# EAGLE design SUSTAINA-Power-Supply-Switching-Board (EAGLE 9.6.2)
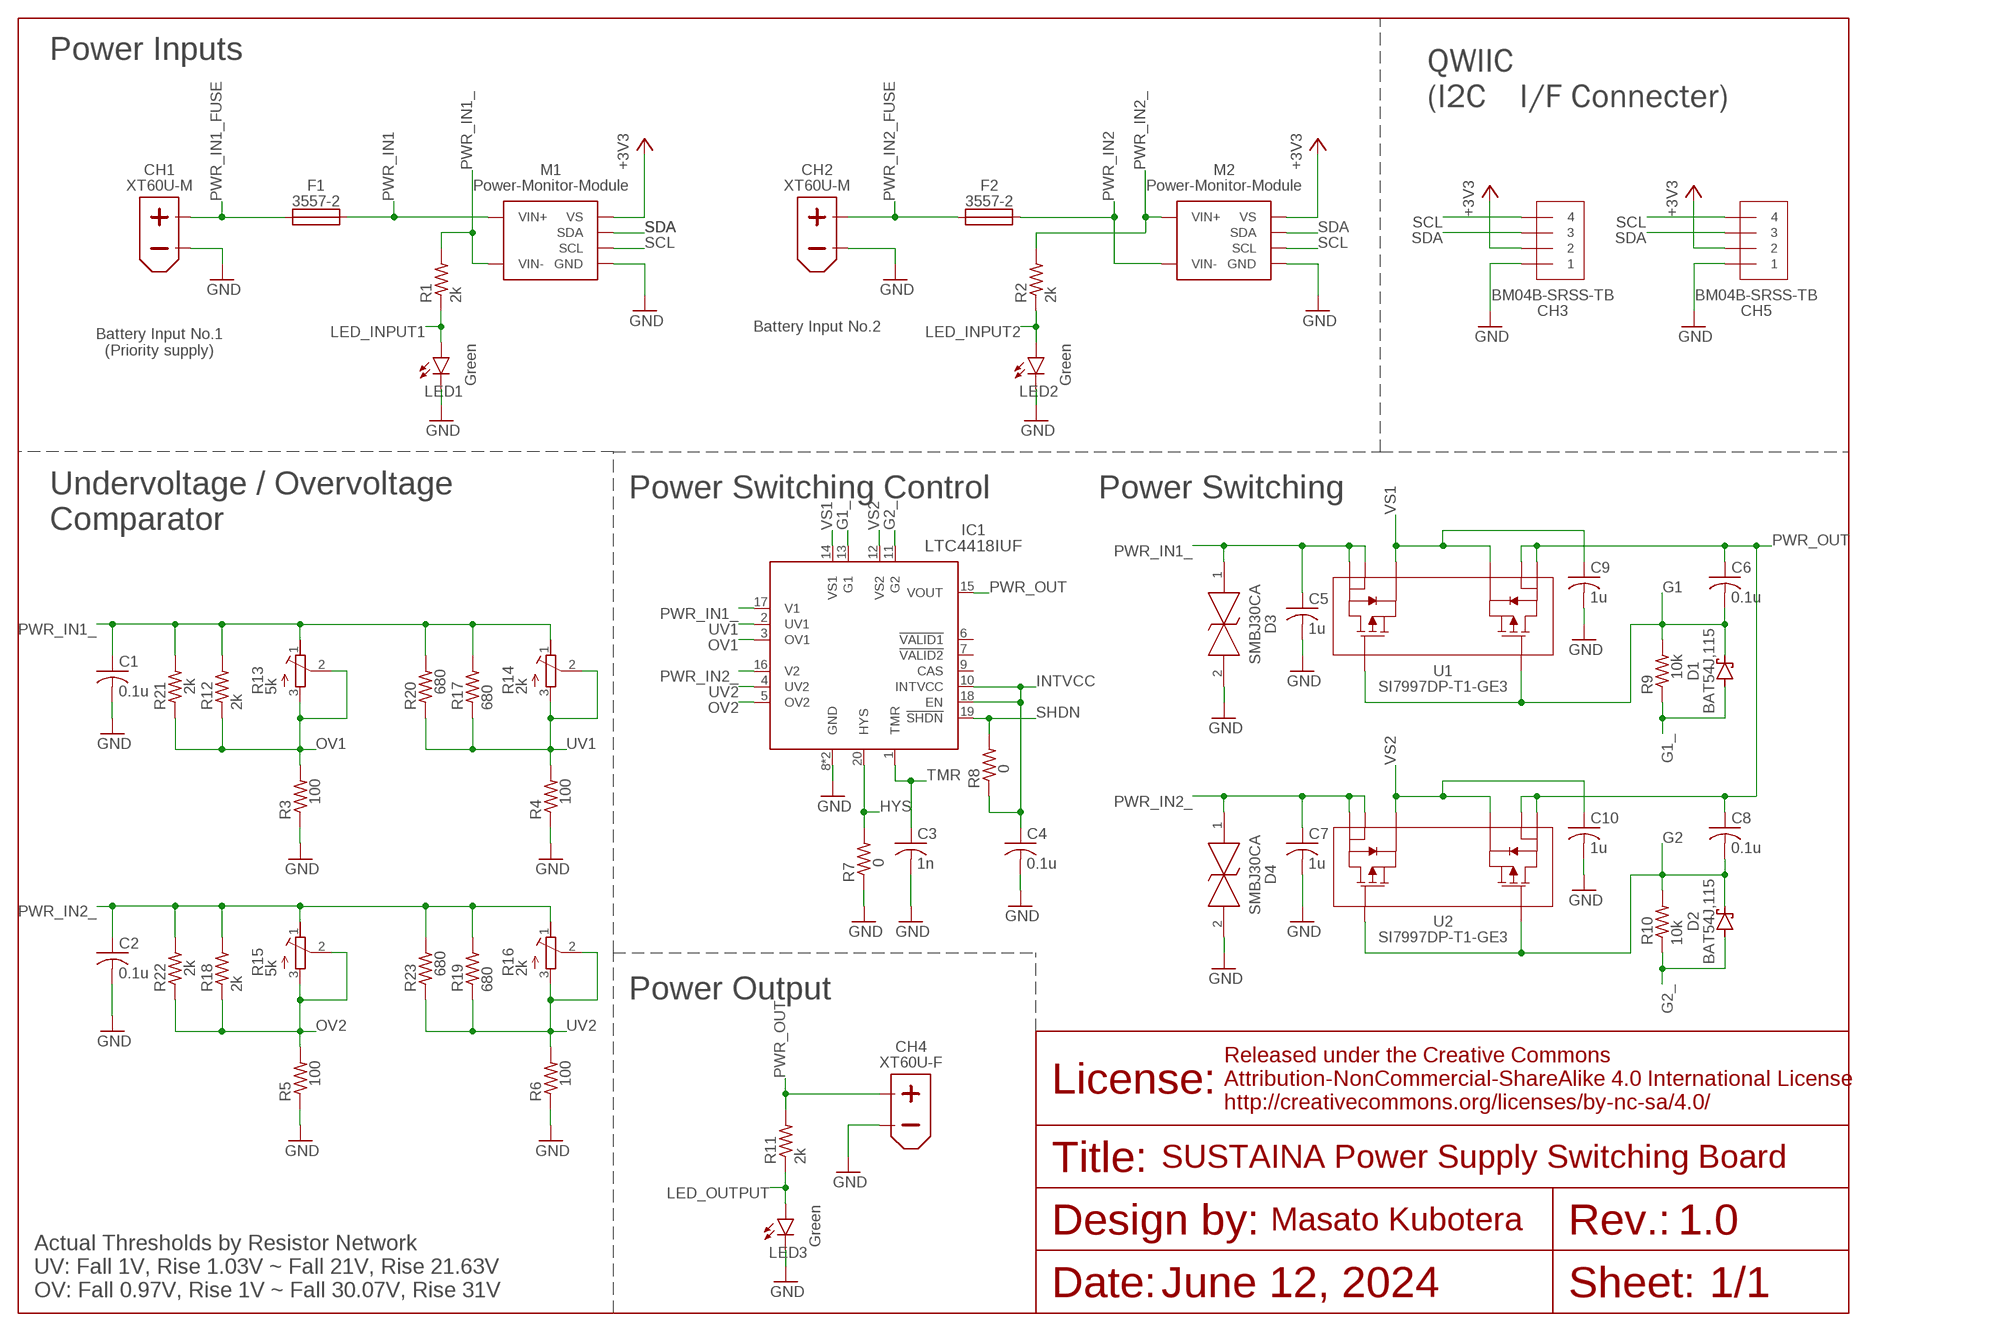
[diagram p0: schematic, sheet 1]

## Parts
C1  0.1u  C-USC0603  [C0603]
C2  0.1u  C-USC0603  [C0603]
C3  1n  C-USC0603  [C0603]
C4  0.1u  C-USC0603  [C0603]
C5  1u  C-USC0603  [C0603]
C6  0.1u  C-USC0603  [C0603]
C7  1u  C-USC0603  [C0603]
C8  0.1u  C-USC0603  [C0603]
C9  1u  C-USC0603  [C0603]
C10  1u  C-USC0603  [C0603]
CH1  XT60U-M  [XT60U-M]
CH2  XT60U-M  [XT60U-M]
CH3  BM04B-SRSS-TB  [BM04B-SRSS-TB]
CH4  XT60U-F  [XT60U-F]
CH5  BM04B-SRSS-TB  [BM04B-SRSS-TB]
D1  BAT54J,115  [SOD-323-2]
D2  BAT54J,115  [SOD-323-2]
D3  SMBJ30CA  [SMBJ30CA]
D4  SMBJ30CA  [SMBJ30CA]
F1  3557-2  [3557-2]
F2  3557-2  [3557-2]
IC1  LTC4418IUF  [LTC4418IUF]
LED1  Green  LEDSML0603  [SML0603]
LED2  Green  LEDSML0603  [SML0603]
LED3  Green  LEDSML0603  [SML0603]
M1  POWER-MONITOR-MODULE  [POWER-MONITOR-MODULE]
M2  POWER-MONITOR-MODULE  [POWER-MONITOR-MODULE]
R1  2k  R-US_R0603  [R0603]
R2  2k  R-US_R0603  [R0603]
R3  100  R-US_R0603  [R0603]
R4  100  R-US_R0603  [R0603]
R5  100  R-US_R0603  [R0603]
R6  100  R-US_R0603  [R0603]
R7  0  R-US_R0603  [R0603]
R8  0  R-US_R0603  [R0603]
R9  10k  R-US_R0603  [R0603]
R10  10k  R-US_R0603  [R0603]
R11  2k  R-US_R0603  [R0603]
R12  2k  R-US_0204/5  [0204/5]
R13  5k  R-TRIMM3006P  [RTRIM3006P]
R14  2k  R-TRIMM3006P  [RTRIM3006P]
R15  5k  R-TRIMM3006P  [RTRIM3006P]
R16  2k  R-TRIMM3006P  [RTRIM3006P]
R17  680  R-US_0204/5  [0204/5]
R18  2k  R-US_0204/5  [0204/5]
R19  680  R-US_0204/5  [0204/5]
R20  680  R-US_R0603  [R0603]
R21  2k  R-US_R0603  [R0603]
R22  2k  R-US_R0603  [R0603]
R23  680  R-US_R0603  [R0603]
U1  SI7997DP-T1-GE3  [POWERPAK_SO-8_VIS]
U2  SI7997DP-T1-GE3  [POWERPAK_SO-8_VIS]

## Nets
+3V3 [low_power]: CH3.2 CH5.2 M1.VS M2.VS
G1 [low_power]: C6.2 D1.1(C) R9.2 U1.2(G1) U1.4(G2)
G1_ [low_power]: D1.2(A) IC1.13(G1) R9.1
G2 [low_power]: C8.2 D2.1(C) R10.2 U2.2(G1) U2.4(G2)
G2_ [low_power]: D2.2(A) IC1.11(G2) R10.1
GND [power]: C1.2 C2.2 C3.2 C4.2 C5.2 C7.2 C9.2 C10.2 CH1.- CH2.- CH3.1 CH4.- CH5.1 D3.2 D4.2 IC1.8(GND) IC1.21(GND) LED1.C LED2.C LED3.C M1.GND M2.GND R3.1 R4.1 R5.1 R6.1 R7.1
HYS [signal]: IC1.20(HYS) R7.2
INTVCC [signal]: C4.1 IC1.10(INTVCC) IC1.18(EN) R8.1
LED_INPUT1 [low_power]: LED1.A R1.1
LED_INPUT2 [low_power]: LED2.A R2.1
LED_OUTPUT [low_power]: LED3.A R11.1
OV1 [low_power]: IC1.3(OV1) R3.2 R12.1 R13.2(S) R13.3(A) R21.1
OV2 [low_power]: IC1.5(OV2) R5.2 R15.2(S) R15.3(A) R18.1 R22.1
PWR_IN1 [power]: F1.3 F1.4 M1.VIN+1(VIN+) M1.VIN+2(VIN+) M1.VIN+3(VIN+) M1.VIN+4(VIN+) M1.VIN+5(VIN+) M1.VIN+6(VIN+) M1.VIN+7(VIN+) M1.VIN+8(VIN+) M1.VIN+9(VIN+) M1.VIN+10(VIN+)
PWR_IN1_ [power]: C1.1 C5.1 D3.1 IC1.17(V1) M1.VIN-1(VIN-) M1.VIN-2(VIN-) M1.VIN-3(VIN-) M1.VIN-4(VIN-) M1.VIN-5(VIN-) M1.VIN-6(VIN-) M1.VIN-7(VIN-) M1.VIN-8(VIN-) M1.VIN-9(VIN-) M1.VIN-10(VIN-) R1.2 R12.2 R13.1(E) R14.1(E) R17.2 R20.2 R21.2 U1.5(D2) U1.6(D2_2)
PWR_IN1_FUSE [power]: CH1.+ F1.1 F1.2
PWR_IN2 [power]: F2.3 F2.4 M2.VIN-1(VIN-) M2.VIN-2(VIN-) M2.VIN-3(VIN-) M2.VIN-4(VIN-) M2.VIN-5(VIN-) M2.VIN-6(VIN-) M2.VIN-7(VIN-) M2.VIN-8(VIN-) M2.VIN-9(VIN-) M2.VIN-10(VIN-)
PWR_IN2_ [power]: C2.1 C7.1 D4.1 IC1.16(V2) M2.VIN+1(VIN+) M2.VIN+2(VIN+) M2.VIN+3(VIN+) M2.VIN+4(VIN+) M2.VIN+5(VIN+) M2.VIN+6(VIN+) M2.VIN+7(VIN+) M2.VIN+8(VIN+) M2.VIN+9(VIN+) M2.VIN+10(VIN+) R2.2 R15.1(E) R16.1(E) R18.2 R19.2 R22.2 R23.2 U2.7(D1) U2.8(D1_2)
PWR_IN2_FUSE [power]: CH2.+ F2.1 F2.2
PWR_OUT [power]: C6.1 C8.1 CH4.+ IC1.15(VOUT) R11.2 U1.7(D1) U1.8(D1_2) U2.5(D2) U2.6(D2_2)
SCL [signal]: CH3.4 CH5.4 M1.SCL M2.SCL
SDA [signal]: CH3.3 CH5.3 M1.SDA M2.SDA
SHDN [signal]: IC1.19(!SHDN) R8.2
TMR [signal]: C3.1 IC1.1(TMR)
UV1 [low_power]: IC1.2(UV1) R4.2 R14.2(S) R14.3(A) R17.1 R20.1
UV2 [low_power]: IC1.4(UV2) R6.2 R16.2(S) R16.3(A) R19.1 R23.1
VS1 [power]: C9.1 IC1.14(VS1) U1.1(S1) U1.3(S2)
VS2 [power]: C10.1 IC1.12(VS2) U2.1(S1) U2.3(S2)
Unconnected: IC1.6(!VALID1) IC1.7(!VALID2) IC1.9(CAS)

## Notes on the sheet
- Power Inputs
- QWIIC
  (I2C　I/F Connecter)
- Battery Input No.2
- Battery Input No.1
  (Priority supply)
- Power Switching Control | Power Switching
- Undervoltage / Overvoltage
  Comparator
- Power Output
- SUSTAINA Power Supply Switching Board
- 1.0
- Actual Thresholds by Resistor Network
  UV: Fall 1V, Rise 1.03V ~ Fall 21V, Rise 21.63V
  OV: Fall 0.97V, Rise 1V ~ Fall 30.07V, Rise 31V
- June 12, 2024 | 1/1

## Library data of the parts
C1-C10 = rcl:C-US: CAPACITOR, American symbol; SPICEPREFIX: C
CH1 CH2 = XT60:XT60U-M
CH3 CH5 = SH-Connecters:BM04B-SRSS-TB
CH4 = XT60:XT60U-F
D1 D2 = BAT54J,115:BAT54J,115
D3 D4 = SMBJ30CA:SMBJ30CA
F1 F2 = 3557-2:3557-2
IC1 = LTC4418IUF:LTC4418IUF
LED1-LED3 = led:LED: LED OSRAM: - CHIPLED LG R971, LG N971, LY N971, LG Q971, LY Q971, LO R971, LY R971 LH N974, LH R974 LS Q976, LO Q976, LY Q976 LO Q996 - Hyper CHIPLED LW Q18S LB Q993, LB Q99A, LB R99A - SideLED LS A670, LO A670, LY A670, LG A670, LP A670 LB A673, LV A673, LT A673, LW A673 LH A674 LY A675 LS A676, LA A676, LO A676, LY A676, LW A676 LS A679, LY A679, LG A679 - Hyper Micro SIDELED® LS Y876, LA Y876, LO Y876, LY Y876 LT Y87S - SmartLED LW L88C, LW L88S LB L89C, LB L89S, LG L890 LS L89K, LO L89K, LY L89K LS L896, LA L896, LO L896, LY L896 - TOPLED LS T670, LO T670, LY T670, LG T670, LP T670 LSG T670, LSP T670, LSY T670, LOP T670, LYG T670 LG T671, LOG T671, LSG T671 LB T673, LV T673, LT T673, LW T673 LH T674 LS T676, LA T676, LO T676, LY T676, LB T676, LH T676, LSB T676, LW T676 LB T67C, LV T67C, LT T67C, LS T67K, LO T67K, LY T67K, LW E67C LS E67B, LA E67B, LO E67B, LY E67B, LB E67C, LV E67C, LT E67C LW T67C LS T679, LY T679, LG T679 LS T770, LO T770, LY T770, LG T770, LP T770 LB T773, LV T773, LT T773, LW T773 LH T774 LS E675, LA E675, LY E675, LS T675 LS T776, LA T776, LO T776, LY T776, LB T776 LHGB T686 LT T68C, LB T68C - Hyper Mini TOPLED® LB M676 - Mini TOPLED Santana® LG M470 LS M47K, LO M47K, LY M47K Source: http://www.osram.convergy.de LUXEON: - LUMILED® LXK2-PW12-R00, LXK2-PW12-S00, LXK2-PW14-U00, LXK2-PW14-V00 LXK2-PM12-R00, LXK2-PM12-S00, LXK2-PM14-U00 LXK2-PE12-Q00, LXK2-PE12-R00, LXK2-PE12-S00, LXK2-PE14-T00, LXK2-PE14-U00 LXK2-PB12-K00, LXK2-PB12-L00, LXK2-PB12-M00, LXK2-PB14-N00, LXK2-PB14-P00, LXK2-PB14-Q00 LXK2-PR12-L00, LXK2-PR12-M00, LXK2-PR14-Q00, LXK2-PR14-R00 LXK2-PD12-Q00, LXK2-PD12-R00, LXK2-PD12-S00 LXK2-PH12-R00, LXK2-PH12-S00 LXK2-PL12-P00, LXK2-PL12-Q00, LXK2-PL12-R00 Source: www.luxeon.com KINGBRIGHT: KA-3528ASYC Source: www.kingbright.com
M1 M2 = Power-Monitor-Module:POWER-MONITOR-MODULE
R1-R12 R17-R23 = rcl:R-US_: RESISTOR, American symbol; SPICEPREFIX: R
R13-R16 = rcl:R-TRIMM: Trimm resistor; SPICEMODEL: X; SPICEPREFIXL: POT
U1 U2 = SI7997DP-T1-GE3:SI7997DP-T1-GE3; COPYRIGHT: Copyright (C) 2024 Ultra Librarian. All rights reserved.; MANUFACTURER_PART_NUMBER: SI7997DP-T1-GE3; MFR_NAME: Vishay

## Net classes
1 signal: width 0.203 mm, clearance 0.127 mm
2 power: width 0.254 mm, clearance 0.127 mm
6 low_power: width 0.254 mm, clearance 0.127 mm

## Board
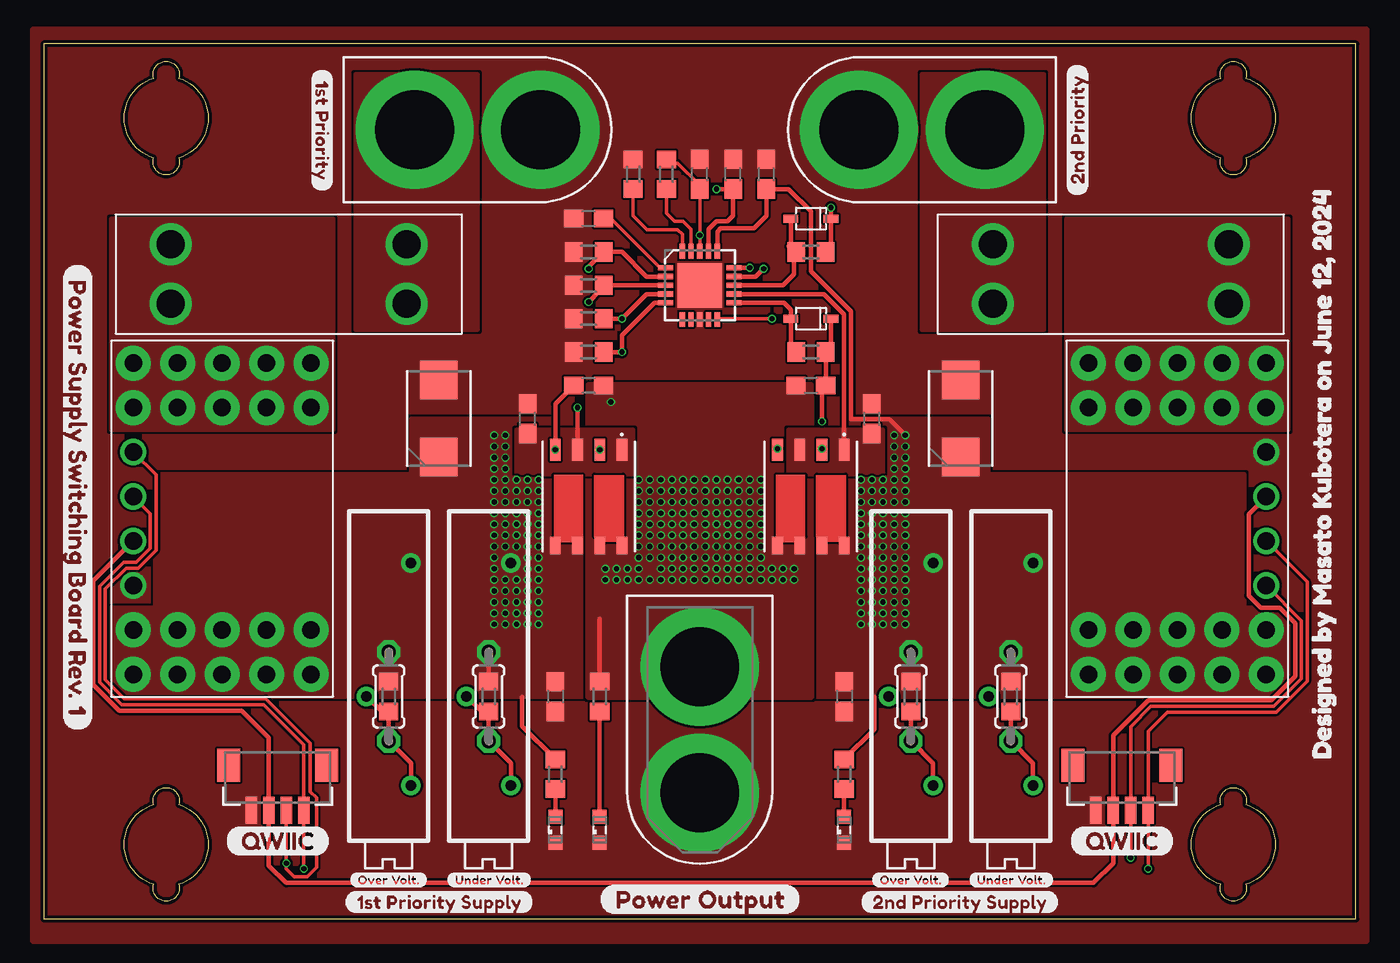
[diagram p1: board, top side]
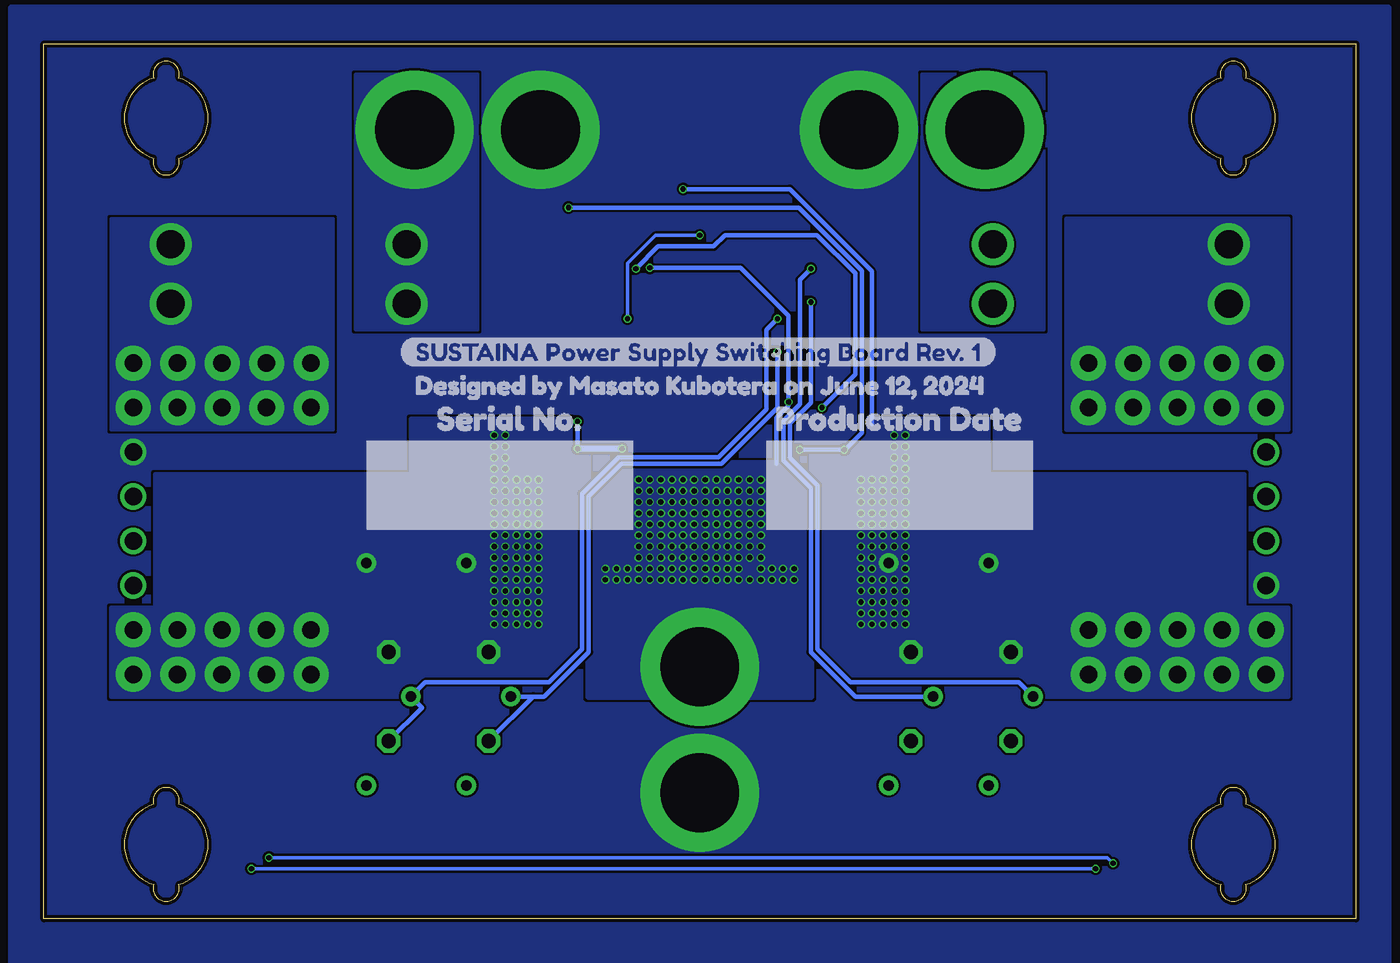
[diagram p2: board, bottom side, seen from below]

Size 75 x 50 mm. Coordinates in mm from the lower left corner, seen from the top.
Outline: 0,0 75,0 75,50 0,50 0,0
Outline: 7.72,43.46 arc-213 6.28,43.46 arc-145 6.28,48.04 arc-213 7.72,48.04 arc-145 7.72,43.46
Outline: 68.72,43.46 arc-213 67.28,43.46 arc-145 67.28,48.04 arc-213 68.72,48.04 arc-145 68.72,43.46
Outline: 67.28,6.54 arc-213 68.72,6.54 arc-145 68.72,1.96 arc-213 67.28,1.96 arc-145 67.28,6.54
Outline: 6.28,6.54 arc-213 7.72,6.54 arc-145 7.72,1.96 arc-213 6.28,1.96 arc-145 6.28,6.54
Copper layers (1*16): Top 0.035mm / dielectric 1.6mm / Bottom 0.035mm
Design rules "jlcpcb-2layers *": minimum track width 5mil, minimum drill 0.3mm, track to track 5mil, track to pad 5mil, pad to pad 5mil, via to via 5mil, smd to smd 5mil, copper to edge 0.2mm, drill to drill 6mil, minimum pad ring 10mil, minimum via ring 3mil, stop-mask expansion 4mil, vias tented up to drill 0.35mm, thermal gap 10mil

### Footprints (pad centres in the part's own frame; a part is rotated, then mirrored left to right if it is on the bottom)
C0603 = smd 1.1 x 1: 1 -0.85,0; 2 0.85,0
XT60U-M = drill 4.5 pad 6.5: + 3.6,0; - -3.6,0
BM04B-SRSS-TB = smd 0.66 x 1.549: 1 1.5,3.33; 2 0.5,3.33; 3 -0.5,3.33; 4 -1.5,3.33 | smd 1.295 x 1.905: 5 2.8,0.75; 6 -2.8,0.75
XT60U-F = drill 4.5 pad 6.5: + 3.6,0; - -3.6,0
SOD-323-2 = smd 0.84 x 0.46: 1 -1.15,0; 2 1.15,0
SMBJ30CA = smd 2.2 x 2.15: 1 -2.2,0; 2 2.2,0
3557-2 = drill 1.6: 1 -6.75,1.7; 2 -6.75,-1.7; 3 6.75,1.7; 4 6.75,-1.7
LTC4418IUF = smd 0.85 x 0.3: 1 -1.95,1; 2 -1.95,0.5; 3 -1.95,0; 4 -1.95,-0.5; 5 -1.95,-1; 11 1.95,-1; 12 1.95,-0.5; 13 1.95,0; 14 1.95,0.5; 15 1.95,1 | smd 0.3 x 0.85: 6 -1,-1.95; 7 -0.5,-1.95; 8 0,-1.95; 9 0.5,-1.95; 10 1,-1.95; 16 1,1.95; 17 0.5,1.95; 18 0,1.95; 19 -0.5,1.95; 20 -1,1.95 | smd 2.55 x 2.55: 21 0,0
SML0603 = smd 0.8 x 0.8: A 0.75,0; C -0.75,0
POWER-MONITOR-MODULE = drill 1: GND 13.97,-11.43; SCL 8.89,-11.43; SDA 6.35,-11.43; VS 11.43,-11.43 | drill 1 pad 2: VIN+1 1.27,-1.27; VIN+2 3.81,-1.27; VIN+3 1.27,-3.81; VIN+4 3.81,-3.81; VIN+5 1.27,-6.35; VIN+6 3.81,-6.35; VIN+7 1.27,-8.89; VIN+8 3.81,-8.89; VIN+9 1.27,-11.43; VIN+10 3.81,-11.43; VIN-1 16.51,-1.27; VIN-2 19.05,-1.27; VIN-3 16.51,-3.81; VIN-4 19.05,-3.81; VIN-5 16.51,-6.35; VIN-6 19.05,-6.35; VIN-7 16.51,-8.89; VIN-8 19.05,-8.89; VIN-9 16.51,-11.43; VIN-10 19.05,-11.43
R0603 = smd 1 x 1.1: 1 -0.85,0; 2 0.85,0
0204/5 = drill 0.813 octagon: 1 -2.54,0; 2 2.54,0
RTRIM3006P = drill 0.61: 1 -7.62,1.27; 2 0,-1.27; 3 5.08,1.27
POWERPAK_SO-8_VIS = smd 1.27 x 0.61: 1 -2.67,1.905; 2 -2.67,0.635; 3 -2.67,-0.635; 4 -2.67,-1.905 | smd 1.016 x 0.61: 5 2.797,-1.905; 6 2.797,-0.635; 7 2.797,0.635; 8 2.797,1.905

### Placement (x,y rotation side)
C1  39.41,42.55 90 top
C2  41.31,42.55 90 top
C3  31.15,40.01 180 top
C4  37.5,42.55 90 top
C5  29.24,12.7 270 top
C6  31.15,30.48 180 top
C7  45.76,12.7 270 top
C8  43.85,30.48 0 top
C9  27.66,28.57 90 top
C10  47.34,28.57 90 top
CH1  24.8,45.09 180 top
CH2  50.2,45.09 0 top
CH3  13.37,9.53 180 top
CH4  37.5,10.79 90 top
CH5  61.63,9.53 180 top
D1  43.85,40.01 180 top
D2  43.85,34.29 180 top
D3  22.58,28.57 90 top
D4  52.42,28.57 90 top
F1  14,36.83 180 top
F2  61,36.83 0 top
IC1  37.5,36.2 0 top
LED1  29.24,5.08 90 top
LED2  45.76,5.08 90 top
LED3  31.79,5.08 90 top
M1  16.55,33.02 270 top
M2  58.45,12.7 90 top
R1  29.24,8.26 90 top
R2  45.76,8.26 90 top
R3  31.15,36.2 0 top
R4  31.15,38.1 0 top
R5  31.15,32.38 0 top
R6  31.15,34.29 0 top
R7  33.69,42.55 270 top
R8  35.59,42.55 270 top
R9  43.85,38.1 0 top
R10  43.85,32.38 0 top
R11  31.79,12.7 90 top
R12  19.72,12.7 90 top
R13  19.72,12.7 270 top
R14  25.44,12.7 270 top
R15  49.56,12.7 270 top
R16  55.28,12.7 270 top
R17  25.44,12.7 90 top
R18  49.56,12.7 90 top
R19  55.28,12.7 90 top
R20  25.44,12.7 90 top
R21  19.72,12.7 90 top
R22  49.56,12.7 90 top
R23  55.28,12.7 90 top
U1  31.15,24.13 270 top
U2  43.85,24.13 270 top
U$1  [SUSTAINA_POWER_SUPPLY_SWITCHING_BOARD_REV#_1]  54.64,32.38 0 bottom
U$2  [DESIGNED_BY_MASATO_KUBOTERA_ON_JUNE_12]  54.64,30.48 0 bottom
U$3  [1ST_PRIORITY]  15.91,48.58 270 top
U$4  [2ND_PRIORITY]  59.09,41.27 90 top
U$5  [POWER_OUTPUT0]  31.79,1.11 0 top
U$6  [1ST_PRIORITY_SUPPLY1]  17.18,0.95 0 top
U$7  [2ND_PRIORITY_SUPPLY1]  46.71,0.95 0 top
U$8  [UNDER_VOLT#0]  52.9,2.22 0 top
U$9  [UNDER_VOLT#0]  23.05,2.22 0 top
U$10  [OVER_VOLT#0]  47.34,2.22 0 top
U$11  [OVER_VOLT#0]  17.5,2.22 0 top
U$12  [QWIIC0]  10.35,4.45 0 top
U$13  [QWIIC0]  58.61,4.45 0 top
U$14  [POWER_SUPPLY_SWITCHING_BOARD_REV#_1]  1.94,37.47 270 top
U$15  [DESIGNED_BY_MASATO_KUBOTERA_ON_JUNE_12]  73.06,8.26 90 top
U$16  SERIAL_NO#0  [SERIAL_NO#0]  53.69,28.57 0 bottom
U$29  PRODUCTION_DATE0  [PRODUCTION_DATE0]  34.33,28.57 0 bottom

### Tracks (layer width: path | path; a pad name or v marks a point on that pad's centre or on a via)
+3V3
  Top 0.254: M1.VS 2.84,19.32 2.84,13.37 4.32,11.89 11.32,11.89 12.87,10.34 CH3.2 12.87,3.04 13.86,2.05 60,2.05 61.13,3.17 CH5.2 61.13,10.48 63.14,12.49 70.18,12.49 71.54,13.85 71.54,16.89 70.67,17.76 69.58,17.76 68.88,18.47 68.88,23.12 M2.VS
G1  (via drill 0.3)
  Top 0.254: R9.2 45.02,37.78 45,37.78 D1.1 v45,40.64 | C6.2 29.24,29.43 v29.24,26.8
  Bottom 0.254: v45,40.64 31.84,40.64 28.23,37.03 28.23,27.78 29.09,26.92 29.12,26.92 v29.24,26.8 U1.2
  other vias: 31.79,26.8
G1_
  Top 0.254: 42.7,37.66 42.7,38.42 | 42.7,38.42 D1.2 | IC1.13 42.26,36.2 42.9,36.83 42.9,38 R9.1 42.9,38.42 42.7,38.42 | 42.58,38.42 42.7,38.42
G2  (via drill 0.3)
  Top 0.254: D2.1 45,32.38 R10.2 C8.2 44.48,30.27 v44.48,28.42 | U2.4 v41.95,26.86 41.95,26.99 | U2.2 v44.48,26.86
  Bottom 0.254: v44.48,26.86 v44.48,28.42
  Bottom 0.381: v44.48,26.86 v41.95,26.86
G2_
  Top 0.254: R10.1 42.7,32.38 D2.2 42.7,34.8 42.31,35.2 IC1.11
GND
  pour Top (rank 6, no thermals): -0.6,50.8 -0.6,-1.27 75.6,-1.27 75.6,50.8
  pour Bottom (rank 6, no thermals): -1.87,52.07 -1.87,-2.54 76.87,-2.54 76.87,52.07
HYS
  Top 0.203: IC1.20 36.5,39.1 36.23,39.37 34.48,39.37 33.69,40.16 R7.2
INTVCC  (via drill 0.3)
  Top 0.203: v41.63,34.29 38.45,34.29 IC1.10 | IC1.18 v37.5,39.05 C4.1 37.5,41.91 36.23,43.18 35.59,43.18 R8.1
  Bottom 0.203: v41.63,34.29 41.63,37.47 40.04,39.05 v37.5,39.05
LED_INPUT1
  Top 0.254: LED1.A R1.1
LED_INPUT2
  Top 0.254: R2.1 LED2.A
LED_OUTPUT
  Top 0.254: R11.1 LED3.A
OV1  (via drill 0.3)
  Top 0.254: IC1.3 R3.2 32,35.88 31.79,35.88 v31.15,35.24 | R13.3 20.99,8.89 R12.1 R21.1 19.3,11.85 R13.2
  Bottom 0.254: R13.2 19.26,13.51 28.88,13.51 30.77,15.4 30.77,24.77 32.34,26.34 32.34,28.31 31.15,29.5 v31.15,35.24
OV2  (via drill 0.3)
  Top 0.254: R5.2 v33.05,32.38 33.05,33.34 34.91,35.2 IC1.5 | R15.3 50.84,8.89 R18.1 R22.1
  Bottom 0.254: v33.05,32.38 33.05,29.21 36.27,26 41.98,26 43.85,24.13 43.85,15.24 46.39,12.7 47.02,12.7 | R15.2 47.02,12.7 | 47.02,12.7 R18.1
PWR_IN1
  pour Top (no thermals): 3.84,40.01 3.84,27.94 16.55,27.94 16.55,40.01
  pour Bottom (no thermals): 3.84,40.01 3.84,27.94 16.55,27.94 16.55,40.01
PWR_IN1_  (via drill 0.3)
  Top 0.254: v38.45,41.7 C1.1 39.41,40.16 39.09,39.85 38.45,39.85 38,39.39 IC1.17 | R17.2 R20.2 | R1.2 27.34,11.01 27.34,12.7
  Bottom 0.254: v38.45,41.7 32.35,41.7 27.66,37 27.66,28.26
  other vias: 27.02,16.83 27.66,16.83 27.02,17.46 27.02,18.1 27.66,17.46 28.29,16.83 28.29,17.46 27.66,18.1 27.02,18.73 27.02,19.37 27.66,18.73 28.29,18.1 28.29,18.73 27.66,19.37 27.66,20 28.29,19.37 28.29,20 27.66,20.64 27.02,21.27 27.02,21.91 27.66,21.27 28.29,20.64 28.29,21.27 27.02,22.54 27.66,21.91 27.02,23.18 27.66,22.54 28.29,21.91 28.29,22.54 27.66,23.18 27.02,23.81 26.39,25.08 27.66,23.81 28.29,23.18 27.02,24.45 27.66,24.45 28.29,23.81 27.02,25.08 26.39,25.72 26.39,26.35 27.66,25.08 28.29,24.45 28.29,25.08 26.39,26.99 26.39,27.62 25.75,27.62 25.75,26.99 25.75,26.35 25.75,25.72 26.39,21.91 26.39,24.45 25.75,25.08 26.39,23.81 25.75,24.45 26.39,22.54 26.39,23.18 25.75,23.81 25.75,23.18 25.75,22.54 26.39,21.27 25.75,21.91 25.75,21.27 25.75,20.64 26.39,18.73 26.39,19.37 25.75,20 25.75,19.37 26.39,17.46 26.39,18.1 25.75,18.73 25.75,18.1 26.39,16.83 25.75,17.46 25.75,16.83
  pour Top (rank 3, no thermals): 3.84,12.7 31.15,12.7 31.15,28.57 20.99,28.57 20.99,25.4 6.39,25.4 6.39,17.78 3.84,17.78
  pour Bottom (rank 3, no thermals): 3.84,12.7 31.15,12.7 31.15,28.57 20.99,28.57 20.99,25.4 6.39,25.4 6.39,17.78 3.84,17.78
PWR_IN1_FUSE
  pour Top (no thermals): 24.8,48.26 24.8,33.66 17.82,33.66 17.82,48.26
PWR_IN2
  pour Top (no thermals): 71.16,40.01 58.45,40.01 58.45,27.94 71.16,27.94
  pour Bottom (no thermals): 58.45,40.01 58.45,27.94 71.16,27.94 71.16,40.01
PWR_IN2_  (via drill 0.3)
  Top 0.254: C2.1 41.31,40.96 | C2.1 42.58,41.7 43.85,40.42 43.85,36.99 46.14,34.7 46.14,28.53 48.34,28.53 v49.25,27.62 | IC1.16 38.5,39.26 38.69,39.45 40.6,39.45 41.31,40.16 C2.1 | R2.2 47.48,10.83 47.48,12.7
  other vias: 46.71,25.08 46.71,24.45 46.71,23.81 46.71,23.18 46.71,22.54 49.25,25.08 49.25,24.45 49.25,23.81 49.25,23.18 49.25,22.54 48.61,25.08 48.61,24.45 48.61,23.81 48.61,23.18 48.61,22.54 47.98,25.08 47.98,24.45 47.98,23.81 47.98,23.18 47.98,22.54 47.34,25.08 47.34,24.45 47.34,23.81 47.34,23.18 47.34,22.54 46.71,21.91 46.71,21.27 46.71,20.64 46.71,20 46.71,19.37 49.25,21.91 49.25,21.27 49.25,20.64 49.25,20 49.25,19.37 48.61,21.91 48.61,21.27 48.61,20.64 48.61,20 48.61,19.37 47.98,21.91 47.98,21.27 47.98,20.64 47.98,20 47.98,19.37 47.34,21.91 47.34,21.27 47.34,20.64 47.34,20 47.34,19.37 49.25,26.99 49.25,26.35 49.25,25.72 48.61,27.62 48.61,26.99 48.61,26.35 48.61,25.72 46.71,18.73 46.71,18.1 46.71,17.46 46.71,16.83 49.25,18.73 49.25,18.1 49.25,17.46 49.25,16.83 48.61,18.73 48.61,18.1 48.61,17.46 48.61,16.83 47.98,18.73 47.98,18.1 47.98,17.46 47.98,16.83 47.34,18.73 47.34,18.1 47.34,17.46 47.34,16.83
  pour Top (rank 3, no thermals): 71.16,12.7 43.85,12.7 43.85,28.57 54.01,28.57 54.01,25.4 68.61,25.4 68.61,17.78 71.16,17.78
  pour Bottom (rank 3, no thermals): 71.16,12.7 43.85,12.7 43.85,28.57 54.01,28.57 54.01,25.4 68.61,25.4 68.61,17.78 71.16,17.78
PWR_IN2_FUSE
  pour Top (no thermals): 50.2,48.26 50.2,33.66 57.19,33.66 57.19,48.26
  pour Bottom (no thermals): 50.2,48.26 50.2,33.66 57.19,33.66 57.19,48.26
PWR_IN!_FUSE
  pour Bottom: 17.82,48.26 17.82,33.66 24.8,33.66 24.8,48.26
PWR_OUT  (via drill 0.3)
  Top 0.254: 40.41,37.2 v40.36,37.2 IC1.15 | 31.79,17.14 R11.2
  Bottom 0.254: v40.36,37.2 35.17,37.2 32.42,34.45 v32.42,29.53 32.42,29.31 33.1,28.62 33.1,25.99
  other vias: 34.01,25.08 34.01,24.45 34.01,23.81 34.01,23.18 34.01,22.54 36.55,25.08 36.55,24.45 36.55,23.81 36.55,23.18 36.55,22.54 35.91,25.08 35.91,24.45 35.91,23.81 35.91,23.18 35.91,22.54 35.28,25.08 35.28,24.45 35.28,23.81 35.28,23.18 35.28,22.54 34.64,25.08 34.64,24.45 34.64,23.81 34.64,23.18 34.64,22.54 38.45,25.08 38.45,24.45 38.45,23.81 38.45,23.18 38.45,22.54 40.99,25.08 40.99,24.45 40.99,23.81 40.99,23.18 40.99,22.54 40.36,25.08 40.36,24.45 40.36,23.81 40.36,23.18 40.36,22.54 39.72,25.08 39.72,24.45 39.72,23.81 39.72,23.18 39.72,22.54 39.09,25.08 39.09,24.45 39.09,23.81 39.09,23.18 39.09,22.54 37.82,25.08 37.82,24.45 37.82,23.81 37.82,23.18 37.82,22.54 37.18,25.08 37.18,24.45 37.18,23.81 37.18,23.18 37.18,22.54 34.01,21.91 34.01,21.27 34.01,20.64 34.01,20 34.01,19.37 36.55,21.91 36.55,21.27 36.55,20.64 36.55,20 36.55,19.37 35.91,21.91 35.91,21.27 35.91,20.64 35.91,20 35.91,19.37 35.28,21.91 35.28,21.27 35.28,20.64 35.28,20 35.28,19.37 34.64,21.91 34.64,21.27 34.64,20.64 34.64,19.37 38.45,21.91 38.45,21.27 38.45,20.64 38.45,20 38.45,19.37 40.99,21.91 40.99,21.27 40.99,20.64 40.99,20 40.99,19.37 40.36,21.91 40.36,21.27 40.36,20.64 40.36,20 40.36,19.37 39.72,21.91 39.72,21.27 39.72,20.64 39.72,20 39.72,19.37 39.09,21.91 39.09,21.27 39.09,20.64 39.09,20 39.09,19.37 37.82,21.91 37.82,21.27 37.82,20.64 37.82,20 37.82,19.37 37.18,21.91 37.18,21.27 37.18,20.64 37.18,20 37.18,19.37 32.1,20 32.1,19.37 33.37,20 33.37,19.37 32.74,20 32.74,19.37 41.63,20 41.63,19.37 42.9,20 42.9,19.37 42.26,20 42.26,19.37
  pour Top (rank 2, no thermals): 43.85,12.7 31.15,12.7 31.15,30.48 43.85,30.48
  pour Bottom (rank 2, no thermals): 43.85,12.7 31.15,12.7 31.15,26.04 43.85,26.04
SCL  (via drill 0.3)
  Top 0.203: 14.96,6.35 CH3.4 | CH3.4 v14.87,2.86 | v63.13,2.86 CH5.4 63.13,10.71 64.23,11.8 70.46,11.8 72.22,13.57 72.22,19.25 M2.SCL | M1.SCL 6.1,23.15 6.1,21.18 5.28,20.36 4.57,20.36 3.2,18.99 3.2,13.52 4.47,12.24 12.56,12.24 14.87,9.93 CH3.4
  Bottom 0.203: v63.13,2.86 v14.87,2.86
SDA  (via drill 0.3)
  Top 0.203: CH3.3 v13.87,3.17 13.87,2.86 14.32,2.4 15.06,2.4 15.59,2.94 15.59,6.9 15.23,7.26 15.23,10.03 12.7,12.57 4.61,12.57 3.53,13.65 3.53,18.85 4.71,20.03 5.41,20.03 6.43,21.05 6.43,25.36 M1.SDA | 62.27,6.67 61.95,6.35 CH5.3 | v62.13,3.49 CH5.3 | M2.SDA 71.89,17.04 71.89,13.7 70.33,12.13 63.29,12.13 62.13,10.98 CH5.3
  Bottom 0.203: v13.87,3.17 14.19,3.49 v62.13,3.49
SHDN
  Top 0.203: R8.2 35.59,40.32 36.07,39.85 36.55,39.85 37,39.39 IC1.19
TMR
  Top 0.203: IC1.1 35.28,37.15 32.1,40.32 31.79,40.01 C3.1
UV1  (via drill 0.3)
  Top 0.254: v31.15,37.15 31.15,37.25 R4.2 33.05,38.1 34.46,36.7 IC1.2 | R14.3 26.7,8.89 R17.1 R20.1 25.02,11.85 R14.2
  Bottom 0.254: v31.15,37.15 31.79,36.51 31.79,29.4 32.72,28.46 32.72,26.18 31.15,24.61 31.15,15.24 28.61,12.7 R14.2
UV2  (via drill 0.3)
  Top 0.254: R6.2 v33.05,34.29 34.46,35.7 IC1.4 | R16.3 56.55,8.89 R19.1 R23.1
  Bottom 0.254: v33.05,34.29 33.69,33.66 33.69,29.11 36.43,26.38 42.14,26.38 44.23,24.29 44.23,15.4 46.12,13.51 53.2,13.51 R16.2 53.38,12.06 R19.1
VS1  (via drill 0.3)
  Top 0.254: IC1.14 40.7,36.7 v41.15,37.15 | v30.52,29.21 30.52,27.3
  Bottom 0.254: v41.15,37.15 39.88,38.42 36.71,38.42 36.07,39.05 30.79,39.05 28.61,36.87 28.61,31.11 v30.52,29.21
  pour Top (no thermals): 27.02,27.94 27.02,25.4 33.69,25.4 33.69,27.94
VS2
  Top 0.254: IC1.12 44.6,35.7 45.76,34.54 U2.1
  pour Top (no thermals): 42.58,27.94 42.58,25.4 47.98,25.4 47.98,27.94